# Altium schematic sheet SAMA7G54_PIO.SchDoc
size 420 x 297 mm; SheetNumber: 11; SheetTotal: 34
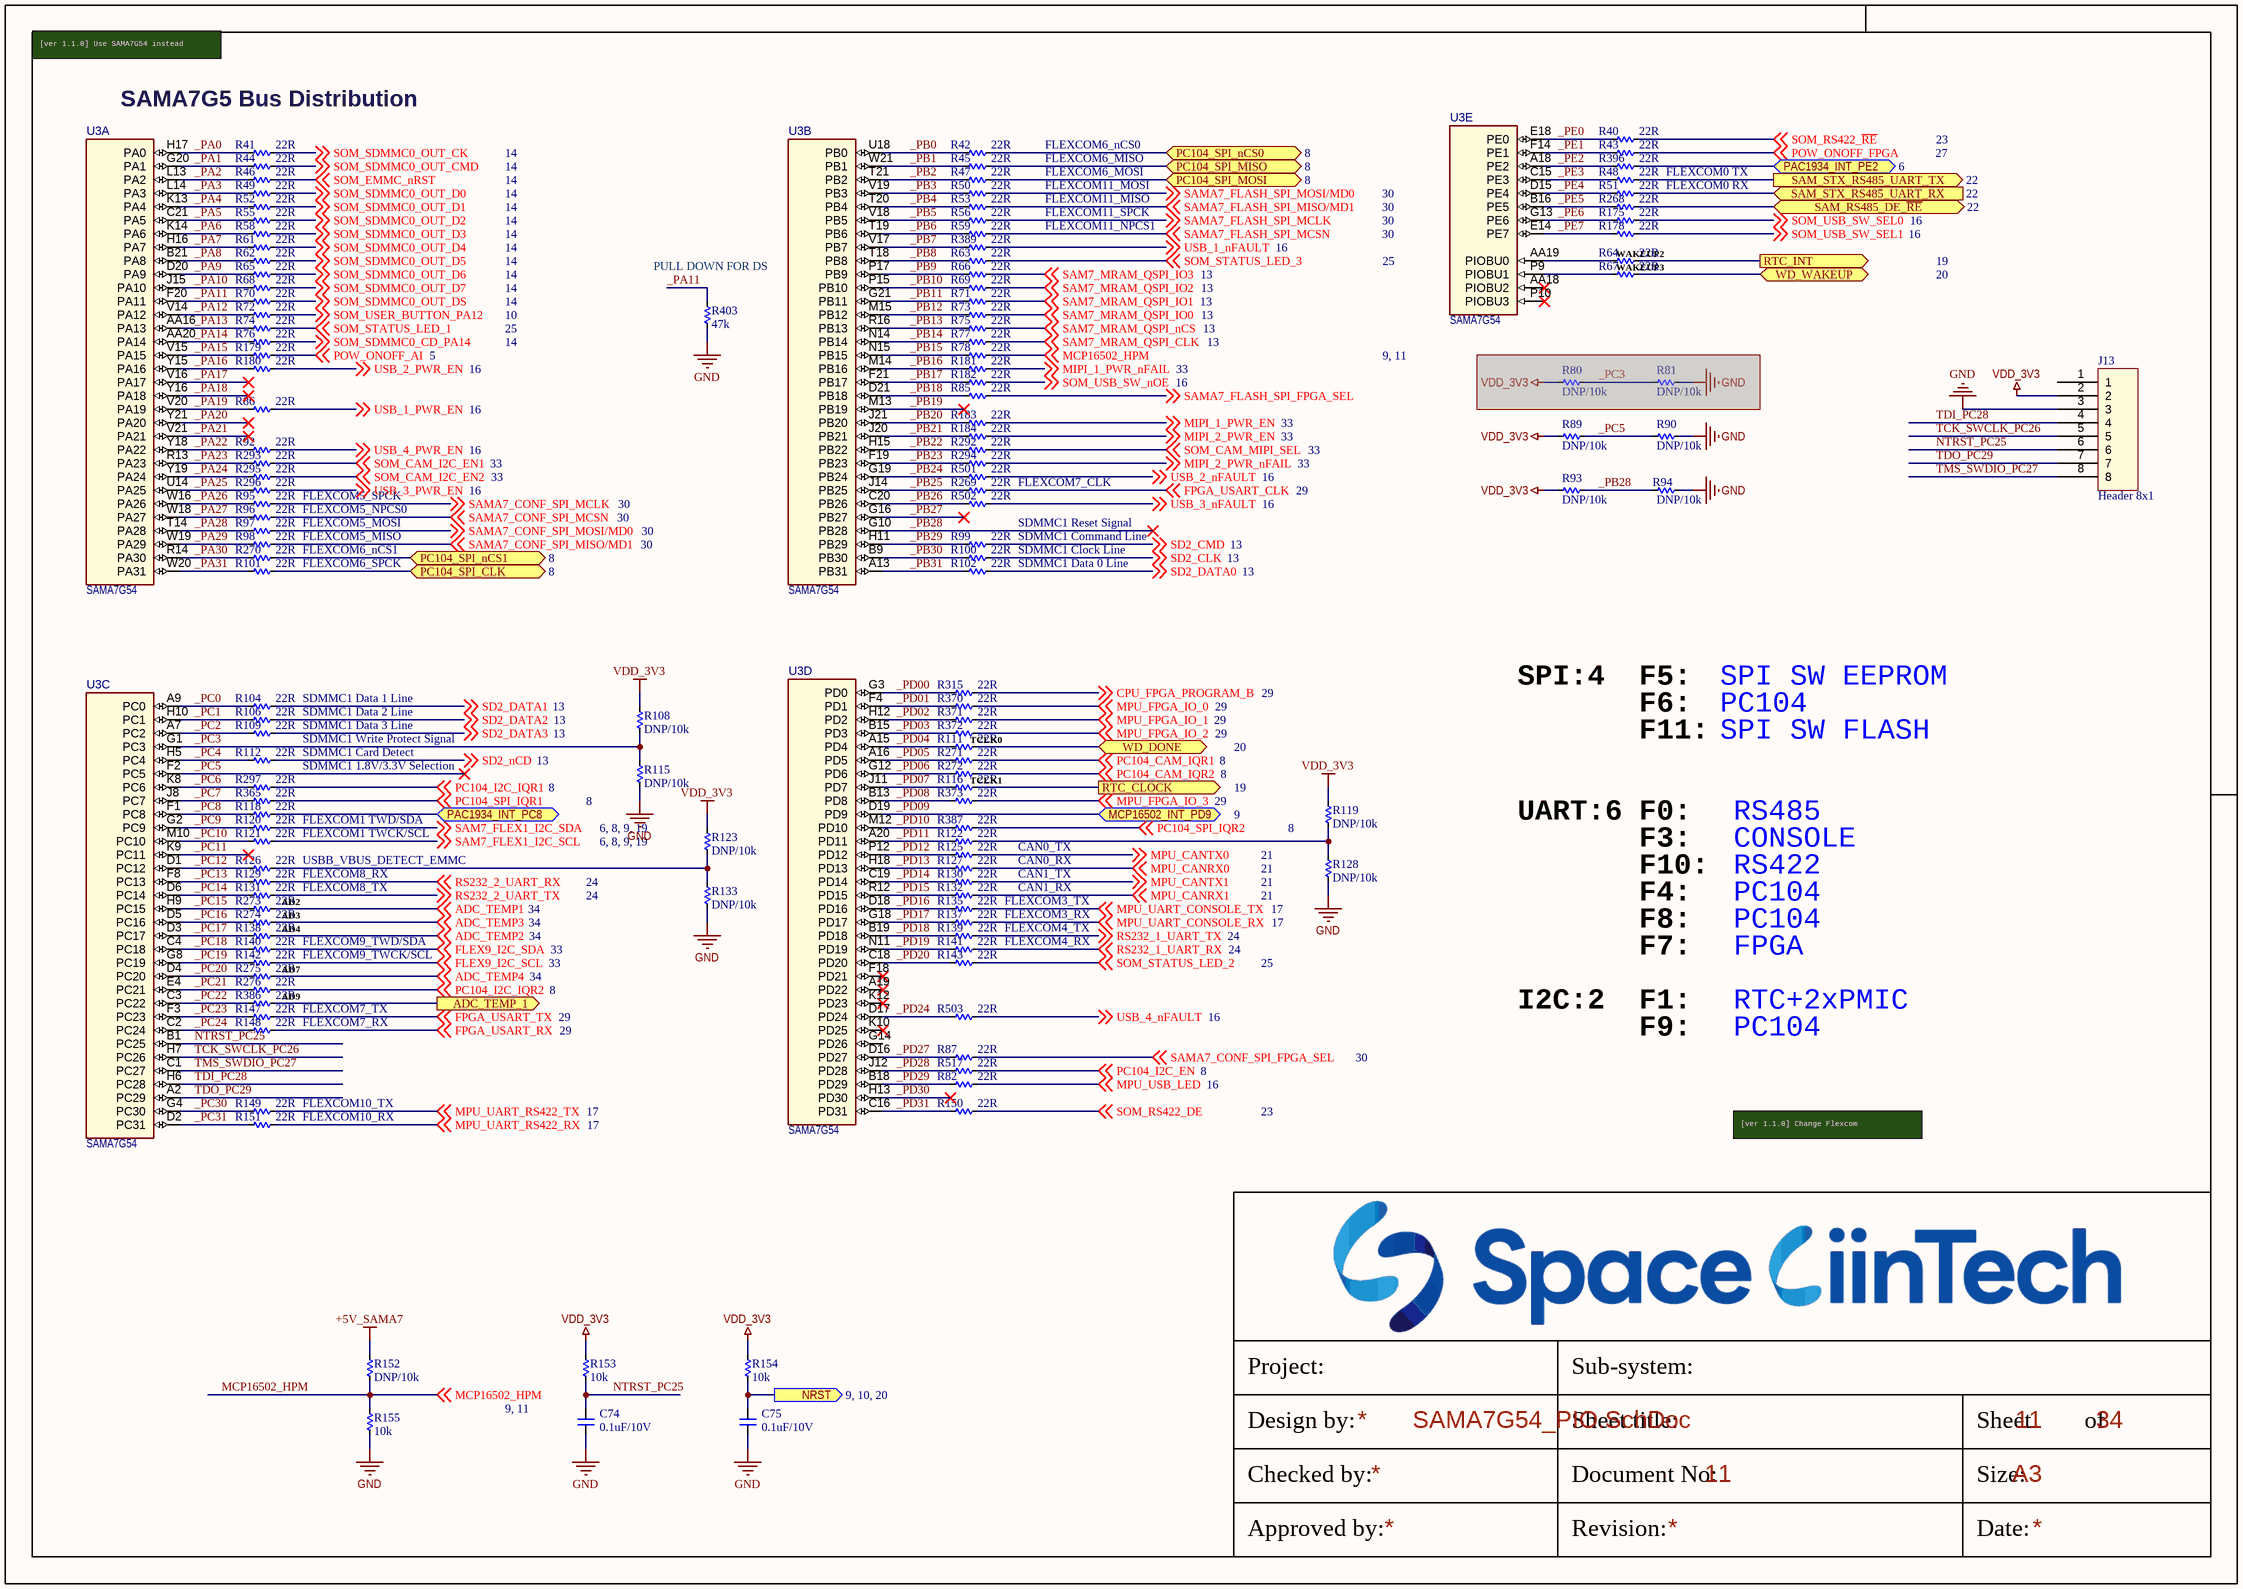
[diagram p0: SAMA7G54_PIO.SchDoc]

## Parts
C74  0.1uF/10V  [CAP_C_1005X50_L]
C75  0.1uF/10V  [CAP_C_1005X50_L]
J13  Header 8x1  [PAD JTAG 1.27]
R40  22R  [RES_C_1005x30_L]
R41  22R  [RES_C_1005x30_L]
R42  22R  [RES_C_1005x30_L]
R43  22R  [RES_C_1005x30_L]
R44  22R  [RES_C_1005x30_L]
R45  22R  [RES_C_1005x30_L]
R46  22R  [RES_C_1005x30_L]
R47  22R  [RES_C_1005x30_L]
R48  22R  [RES_C_1005x30_L]
R49  22R  [RES_C_1005x30_L]
R50  22R  [RES_C_1005x30_L]
R51  22R  [RES_C_1005x30_L]
R52  22R  [RES_C_1005x30_L]
R53  22R  [RES_C_1005x30_L]
R55  22R  [RES_C_1005x30_L]
R56  22R  [RES_C_1005x30_L]
R58  22R  [RES_C_1005x30_L]
R59  22R  [RES_C_1005x30_L]
R61  22R  [RES_C_1005x30_L]
R62  22R  [RES_C_1005x30_L]
R63  22R  [RES_C_1005x30_L]
R64  22R  [RES_C_1005x30_L]
R65  22R  [RES_C_1005x30_L]
R66  22R  [RES_C_1005x30_L]
R67  22R  [RES_C_1005x30_L]
R68  22R  [RES_C_1005x30_L]
R69  22R  [RES_C_1005x30_L]
R70  22R  [RES_C_1005x30_L]
R71  22R  [RES_C_1005x30_L]
R72  22R  [RES_C_1005x30_L]
R73  22R  [RES_C_1005x30_L]
R74  22R  [RES_C_1005x30_L]
R75  22R  [RES_C_1005x30_L]
R76  22R  [RES_C_1005x30_L]
R77  22R  [RES_C_1005x30_L]
R78  22R  [RES_C_1005x30_L]
R80  DNP/10k  [RES_C_1005x30_L]  (masked out: inside a compile mask, not in the netlist)
R81  DNP/10k  [RES_C_1005x30_L]  (masked out: inside a compile mask, not in the netlist)
R82  22R  [RES_C_1005x30_L]
R85  22R  [RES_C_1005x30_L]
R86  22R  [RES_C_1005x30_L]
R87  22R  [RES_C_1005x30_L]
R89  DNP/10k  [RES_C_1005x30_L]
R90  DNP/10k  [RES_C_1005x30_L]
R92  22R  [RES_C_1005x30_L]
R93  DNP/10k  [RES_C_1005x30_L]
R94  DNP/10k  [RES_C_1005x30_L]
R95  22R  [RES_C_1005x30_L]
R96  22R  [RES_C_1005x30_L]
R97  22R  [RES_C_1005x30_L]
R98  22R  [RES_C_1005x30_L]
R99  22R  [RES_C_1005x30_L]
R100  22R  [RES_C_1005x30_L]
R101  22R  [RES_C_1005x30_L]
R102  22R  [RES_C_1005x30_L]
R104  22R  [RES_C_1005x30_L]
R106  22R  [RES_C_1005x30_L]
R108  DNP/10k  [RES_C_1005x30_L]
R109  22R  [RES_C_1005x30_L]
R111  22R  [RES_C_1005x30_L]
R112  22R  [RES_C_1005x30_L]
R115  DNP/10k  [RES_C_1005x30_L]
R116  22R  [RES_C_1005x30_L]
R118  22R  [RES_C_1005x30_L]
R119  DNP/10k  [RES_C_1005x30_L]
R120  22R  [RES_C_1005x30_L]
R121  22R  [RES_C_1005x30_L]
R122  22R  [RES_C_1005x30_L]
R123  DNP/10k  [RES_C_1005x30_L]
R125  22R  [RES_C_1005x30_L]
R126  22R  [RES_C_1005x30_L]
R127  22R  [RES_C_1005x30_L]
R128  DNP/10k  [RES_C_1005x30_L]
R129  22R  [RES_C_1005x30_L]
R130  22R  [RES_C_1005x30_L]
R131  22R  [RES_C_1005x30_L]
R132  22R  [RES_C_1005x30_L]
R133  DNP/10k  [RES_C_1005x30_L]
R135  22R  [RES_C_1005x30_L]
R137  22R  [RES_C_1005x30_L]
R138  22R  [RES_C_1005x30_L]
R139  22R  [RES_C_1005x30_L]
R140  22R  [RES_C_1005x30_L]
R141  22R  [RES_C_1005x30_L]
R142  22R  [RES_C_1005x30_L]
R143  22R  [RES_C_1005x30_L]
R147  22R  [RES_C_1005x30_L]
R148  22R  [RES_C_1005x30_L]
R149  22R  [RES_C_1005x30_L]
R150  22R  [RES_C_1005x30_L]
R151  22R  [RES_C_1005x30_L]
R152  DNP/10k  [RES_C_1005x30_L]
R153  10k  [RES_C_1005x30_L]
R154  10k  [RES_C_1005x30_L]
R155  10k  [RES_C_1005x30_L]
R175  22R  [RES_C_1005x30_L]
R178  22R  [RES_C_1005x30_L]
R179  22R  [RES_C_1005x30_L]
R180  22R  [RES_C_1005x30_L]
R181  22R  [RES_C_1005x30_L]
R182  22R  [RES_C_1005x30_L]
R183  22R  [RES_C_1005x30_L]
R184  22R  [RES_C_1005x30_L]
R268  22R  [RES_C_1005x30_L]
R269  22R  [RES_C_1005x30_L]
R270  22R  [RES_C_1005x30_L]
R271  22R  [RES_C_1005x30_L]
R272  22R  [RES_C_1005x30_L]
R273  22R  [RES_C_1005x30_L]
R274  22R  [RES_C_1005x30_L]
R275  22R  [RES_C_1005x30_L]
R276  22R  [RES_C_1005x30_L]
R292  22R  [RES_C_1005x30_L]
R293  22R  [RES_C_1005x30_L]
R294  22R  [RES_C_1005x30_L]
R295  22R  [RES_C_1005x30_L]
R296  22R  [RES_C_1005x30_L]
R297  22R  [RES_C_1005x30_L]
R315  22R  [RES_C_1005x30_L]
R365  22R  [RES_C_1005x30_L]
R370  22R  [RES_C_1005x30_L]
R371  22R  [RES_C_1005x30_L]
R372  22R  [RES_C_1005x30_L]
R373  22R  [RES_C_1005x30_L]
R386  22R  [RES_C_1005x30_L]
R387  22R  [RES_C_1005x30_L]
R389  22R  [RES_C_1005x30_L]
R396  22R  [RES_C_1005x30_L]
R403  47k  [RES_C_1005x30_L]
R501  22R  [RES_C_1005x30_L]
R502  22R  [RES_C_1005x30_L]
R503  22R  [RES_C_1005x30_L]
R517  22R  [RES_C_1005x30_L]
U3  SAMA7G54  [TFBGA-343_14x14 - 2.5mm]  (parts A,B,C,D,E of 8)

## Ports
ADC_TEMP_1 (out, see 18), MCP16502_INT_PD9 (bidir, see 9), NRST (out, see 9, 10, 20), PAC1934_INT_PC8 (bidir, see 9), PAC1934_INT_PE2 (bidir, see 6), PC104_SPI_CLK (bidir, see 8), PC104_SPI_MISO (bidir, see 8), PC104_SPI_MOSI (bidir, see 8), PC104_SPI_nCS0 (bidir, see 8), PC104_SPI_nCS1 (bidir, see 8), RTC_CLOCK (out, see 19), RTC_INT (out, see 19), SAM_RS485_DE_~{RE} (bidir, see 22), SAM_STX_RS485_UART_RX (in, see 22), SAM_STX_RS485_UART_TX (out, see 22), WD_DONE (bidir, see 20), WD_WAKEUP (bidir, see 20)

## Nets
+5V_SAMA7: R152.1
GND: C74.1 C75.1 J13.3 R90.1 R94.1 R115.2 R128.2 R133.2 R155.2 R403.2
VDD_3V3: J13.2 R89.2 R93.2 R108.1 R119.1 R123.1 R153.2 R154.2
_PA0: R41.2 U3.H17(PA0)
_PA1: R44.2 U3.G20(PA1)
_PA2: R46.2 U3.L13(PA2)
_PA3: R49.2 U3.L14(PA3)
_PA4: R52.2 U3.K13(PA4)
_PA5: R55.2 U3.C21(PA5)
_PA6: R58.2 U3.K14(PA6)
_PA7: R61.2 U3.H16(PA7)
_PA8: R62.2 U3.B21(PA8)
_PA9: R65.2 U3.D20(PA9)
_PA10: R68.2 U3.J15(PA10)
_PA11: R70.2 R403.1 U3.F20(PA11)
_PA12: R72.2 U3.V14(PA12)
_PA13: R74.2 U3.AA16(PA13)
_PA14: R76.2 U3.AA20(PA14)
_PA15: R179.2 U3.V15(PA15)
_PA16: R180.2 U3.Y15(PA16)
_PA17: U3.V16(PA17)
_PA18: U3.Y16(PA18)
_PA19: R86.2 U3.V20(PA19)
_PA20: U3.Y21(PA20)
_PA21: U3.V21(PA21)
_PA22: R92.2 U3.Y18(PA22)
_PA23: R293.2 U3.R13(PA23)
_PA24: R295.2 U3.Y19(PA24)
_PA25: R296.2 U3.U14(PA25)
_PA26: R95.2 U3.W16(PA26)
_PA27: R96.2 U3.W18(PA27)
_PA28: R97.2 U3.T14(PA28)
_PA29: R98.2 U3.W19(PA29)
_PA30: R270.2 U3.R14(PA30)
_PA31: R101.2 U3.W20(PA31)
_PB0: R42.2 U3.U18(PB0)
_PB1: R45.2 U3.W21(PB1)
_PB2: R47.2 U3.T21(PB2)
_PB3: R50.2 U3.V19(PB3)
_PB4: R53.2 U3.T20(PB4)
_PB5: R56.2 U3.V18(PB5)
_PB6: R59.2 U3.T19(PB6)
_PB7: R389.2 U3.V17(PB7)
_PB8: R63.2 U3.T18(PB8)
_PB9: R66.2 U3.P17(PB9)
_PB10: R69.2 U3.P15(PB10)
_PB11: R71.2 U3.G21(PB11)
_PB12: R73.2 U3.M15(PB12)
_PB13: R75.2 U3.R16(PB13)
_PB14: R77.2 U3.N14(PB14)
_PB15: R78.2 U3.N15(PB15)
_PB16: R181.2 U3.M14(PB16)
_PB17: R182.2 U3.F21(PB17)
_PB18: R85.2 U3.D21(PB18)
_PB19: U3.M13(PB19)
_PB20: R183.2 U3.J21(PB20)
_PB21: R184.2 U3.J20(PB21)
_PB22: R292.2 U3.H15(PB22)
_PB23: R294.2 U3.F19(PB23)
_PB24: R501.2 U3.G19(PB24)
_PB25: R269.2 U3.J14(PB25)
_PB26: R502.2 U3.C20(PB26)
_PB27: U3.G16(PB27)
_PB28: R93.1 R94.2 U3.G10(PB28)
_PB29: R99.2 U3.H11(PB29)
_PB30: R100.2 U3.B9(PB30)
_PB31: R102.2 U3.A13(PB31)
_PC0: R104.2 U3.A9(PC0)
_PC1: R106.2 U3.H10(PC1)
_PC2: R109.2 U3.A7(PC2)
_PC3: R108.2 R115.1 U3.G1(PC3)
_PC4: R112.2 U3.H5(PC4)
_PC5: R89.1 R90.2 U3.F2(PC5)
_PC6: R297.2 U3.K8(PC6)
_PC7: R365.2 U3.J8(PC7)
_PC8: R118.2 U3.F1(PC8)
_PC9: R120.2 U3.G2(PC9)
_PC10: R121.2 U3.M10(PC10)
_PC11: U3.K9(PC11)
_PC12: R126.2 U3.D1(PC12)
_PC13: R129.2 U3.F8(PC13)
_PC14: R131.2 U3.D6(PC14)
_PC15: R273.2 U3.H9(PC15)
_PC16: R274.2 U3.D5(PC16)
_PC17: R138.2 U3.D3(PC17)
_PC18: R140.2 U3.C4(PC18)
_PC19: R142.2 U3.G8(PC19)
_PC20: R275.2 U3.D4(PC20)
_PC21: R276.2 U3.E4(PC21)
_PC22: R386.2 U3.C3(PC22)
_PC23: R147.2 U3.F3(PC23)
_PC24: R148.2 U3.C2(PC24)
_PC30: R149.2 U3.G4(PC30)
_PC31: R151.2 U3.D2(PC31)
_PD00: R315.2 U3.G3(PD0)
_PD01: R370.2 U3.F4(PD1)
_PD02: R371.2 U3.H12(PD2)
_PD03: R372.2 U3.B15(PD3)
_PD04: R111.2 U3.A15(PD4)
_PD05: R271.2 U3.A16(PD5)
_PD06: R272.2 U3.G12(PD6)
_PD07: R116.2 U3.J11(PD7)
_PD08: R373.2 U3.B13(PD8)
_PD09: U3.D19(PD9) ; port MCP16502_INT_PD9
_PD10: R387.2 U3.M12(PD10)
_PD11: R122.2 U3.A20(PD11)
_PD12: R125.2 U3.P12(PD12)
_PD13: R127.2 U3.H18(PD13)
_PD14: R130.2 U3.C19(PD14)
_PD15: R132.2 U3.R12(PD15)
_PD16: R135.2 U3.D18(PD16)
_PD17: R137.2 U3.G18(PD17)
_PD18: R139.2 U3.B19(PD18)
_PD19: R141.2 U3.N11(PD19)
_PD20: R143.2 U3.C18(PD20)
_PD24: R503.2 U3.D17(PD24)
_PD27: R87.2 U3.D16(PD27)
_PD28: R517.2 U3.J12(PD28)
_PD29: R82.2 U3.B18(PD29)
_PD30: U3.H13(PD30)
_PD31: R150.2 U3.C16(PD31)
_PE0: R40.2 U3.E18(PE0)
_PE1: R43.2 U3.F14(PE1)
_PE2: R396.2 U3.A18(PE2)
_PE3: R48.2 U3.C15(PE3)
_PE4: R51.2 U3.D15(PE4)
_PE5: R268.2 U3.B16(PE5)
_PE6: R175.2 U3.G13(PE6)
_PE7: R178.2 U3.E14(PE7)
ADC_TEMP1: R273.1 ; off-sheet ADC_TEMP1
ADC_TEMP2: R138.1 ; off-sheet ADC_TEMP2
ADC_TEMP3: R274.1 ; off-sheet ADC_TEMP3
ADC_TEMP4: R275.1 ; off-sheet ADC_TEMP4
ADC_TEMP_1: R386.1 ; port ADC_TEMP_1
CPU_FPGA_PROGRAM_B: R315.1 ; off-sheet CPU_FPGA_PROGRAM_B
FLEX9_I2C_SCL: R142.1 ; off-sheet FLEX9_I2C_SCL
FLEX9_I2C_SDA: R140.1 ; off-sheet FLEX9_I2C_SDA
FPGA_USART_CLK: R269.1 ; off-sheet FPGA_USART_CLK
FPGA_USART_RX: R148.1 ; off-sheet FPGA_USART_RX
FPGA_USART_TX: R147.1 ; off-sheet FPGA_USART_TX
MCP16502_HPM: R78.1 R152.2 R155.1 ; off-sheet MCP16502_HPM
MIPI_1_PWR_EN: R183.1 ; off-sheet MIPI_1_PWR_EN
MIPI_1_PWR_nFAIL: R181.1 ; off-sheet MIPI_1_PWR_nFAIL
MIPI_2_PWR_EN: R184.1 ; off-sheet MIPI_2_PWR_EN
MIPI_2_PWR_nFAIL: R294.1 ; off-sheet MIPI_2_PWR_nFAIL
MPU_CANRX0: R127.1 ; off-sheet MPU_CANRX0
MPU_CANRX1: R132.1 ; off-sheet MPU_CANRX1
MPU_CANTX0: R125.1 ; off-sheet MPU_CANTX0
MPU_CANTX1: R130.1 ; off-sheet MPU_CANTX1
MPU_FPGA_IO_0: R370.1 ; off-sheet MPU_FPGA_IO_0
MPU_FPGA_IO_1: R371.1 ; off-sheet MPU_FPGA_IO_1
MPU_FPGA_IO_2: R372.1 ; off-sheet MPU_FPGA_IO_2
MPU_FPGA_IO_3: R373.1 ; off-sheet MPU_FPGA_IO_3
MPU_UART_CONSOLE_RX: R137.1 ; off-sheet MPU_UART_CONSOLE_RX
MPU_UART_CONSOLE_TX: R135.1 ; off-sheet MPU_UART_CONSOLE_TX
MPU_UART_RS422_RX: R151.1 ; off-sheet MPU_UART_RS422_RX
MPU_UART_RS422_TX: R149.1 ; off-sheet MPU_UART_RS422_TX
MPU_USB_LED: R82.1 ; off-sheet MPU_USB_LED
NRST: C75.2 R154.1 ; port NRST
NTRST_PC25: C74.2 J13.6 R153.1 U3.B1(PC25)
PAC1934_INT_PC8: R118.1 ; port PAC1934_INT_PC8
PAC1934_INT_PE2: R396.1 ; port PAC1934_INT_PE2
PC104_CAM_IQR1: R271.1 ; off-sheet PC104_CAM_IQR1
PC104_CAM_IQR2: R272.1 ; off-sheet PC104_CAM_IQR2
PC104_I2C_EN: R517.1 ; off-sheet PC104_I2C_EN
PC104_I2C_IQR1: R297.1 ; off-sheet PC104_I2C_IQR1
PC104_I2C_IQR2: R276.1 ; off-sheet PC104_I2C_IQR2
PC104_SPI_CLK: R101.1 ; port PC104_SPI_CLK
PC104_SPI_IQR1: R365.1 ; off-sheet PC104_SPI_IQR1
PC104_SPI_IQR2: R387.1 ; off-sheet PC104_SPI_IQR2
PC104_SPI_MISO: R45.1 ; port PC104_SPI_MISO
PC104_SPI_MOSI: R47.1 ; port PC104_SPI_MOSI
PC104_SPI_nCS0: R42.1 ; port PC104_SPI_nCS0
PC104_SPI_nCS1: R270.1 ; port PC104_SPI_nCS1
POW_ONOFF_AI: R179.1 ; off-sheet POW_ONOFF_AI
POW_ONOFF_FPGA: R43.1 ; off-sheet POW_ONOFF_FPGA
RS232_1_UART_RX: R141.1 ; off-sheet RS232_1_UART_RX
RS232_1_UART_TX: R139.1 ; off-sheet RS232_1_UART_TX
RS232_2_UART_RX: R129.1 ; off-sheet RS232_2_UART_RX
RS232_2_UART_TX: R131.1 ; off-sheet RS232_2_UART_TX
RTC_CLOCK: R116.1 ; port RTC_CLOCK
RTC_INT: R64.1 ; port RTC_INT
SAM7_FLEX1_I2C_SCL: R121.1 ; off-sheet SAM7_FLEX1_I2C_SCL
SAM7_FLEX1_I2C_SDA: R120.1 ; off-sheet SAM7_FLEX1_I2C_SDA
SAM7_MRAM_QSPI_CLK: R77.1 ; off-sheet SAM7_MRAM_QSPI_CLK
SAM7_MRAM_QSPI_IO0: R73.1 ; off-sheet SAM7_MRAM_QSPI_IO0
SAM7_MRAM_QSPI_IO1: R71.1 ; off-sheet SAM7_MRAM_QSPI_IO1
SAM7_MRAM_QSPI_IO2: R69.1 ; off-sheet SAM7_MRAM_QSPI_IO2
SAM7_MRAM_QSPI_IO3: R66.1 ; off-sheet SAM7_MRAM_QSPI_IO3
SAM7_MRAM_QSPI_nCS: R75.1 ; off-sheet SAM7_MRAM_QSPI_nCS
SAM_RS485_DE_~{RE}: R268.1 ; port SAM_RS485_DE_~{RE}
SAM_STX_RS485_UART_RX: R51.1 ; port SAM_STX_RS485_UART_RX
SAM_STX_RS485_UART_TX: R48.1 ; port SAM_STX_RS485_UART_TX
SAMA7_CONF_SPI_FPGA_SEL: R87.1 ; off-sheet SAMA7_CONF_SPI_FPGA_SEL
SAMA7_CONF_SPI_MCLK: R95.1 ; off-sheet SAMA7_CONF_SPI_MCLK
SAMA7_CONF_SPI_MCSN: R96.1 ; off-sheet SAMA7_CONF_SPI_MCSN
SAMA7_CONF_SPI_MISO/MD1: R98.1 ; off-sheet SAMA7_CONF_SPI_MISO/MD1
SAMA7_CONF_SPI_MOSI/MD0: R97.1 ; off-sheet SAMA7_CONF_SPI_MOSI/MD0
SAMA7_FLASH_SPI_FPGA_SEL: R85.1 ; off-sheet SAMA7_FLASH_SPI_FPGA_SEL
SAMA7_FLASH_SPI_MCLK: R56.1 ; off-sheet SAMA7_FLASH_SPI_MCLK
SAMA7_FLASH_SPI_MCSN: R59.1 ; off-sheet SAMA7_FLASH_SPI_MCSN
SAMA7_FLASH_SPI_MISO/MD1: R53.1 ; off-sheet SAMA7_FLASH_SPI_MISO/MD1
SAMA7_FLASH_SPI_MOSI/MD0: R50.1 ; off-sheet SAMA7_FLASH_SPI_MOSI/MD0
SD2_CLK: R100.1 ; off-sheet SD2_CLK
SD2_CMD: R99.1 ; off-sheet SD2_CMD
SD2_DATA0: R102.1 ; off-sheet SD2_DATA0
SD2_DATA1: R104.1 ; off-sheet SD2_DATA1
SD2_DATA2: R106.1 ; off-sheet SD2_DATA2
SD2_DATA3: R109.1 ; off-sheet SD2_DATA3
SD2_nCD: R112.1 ; off-sheet SD2_nCD
SOM_CAM_I2C_EN1: R293.1 ; off-sheet SOM_CAM_I2C_EN1
SOM_CAM_I2C_EN2: R295.1 ; off-sheet SOM_CAM_I2C_EN2
SOM_CAM_MIPI_SEL: R292.1 ; off-sheet SOM_CAM_MIPI_SEL
SOM_EMMC_nRST: R46.1 ; off-sheet SOM_EMMC_nRST
SOM_RS422_DE: R150.1 ; off-sheet SOM_RS422_DE
SOM_RS422_~{RE}: R40.1 ; off-sheet SOM_RS422_~{RE}
SOM_SDMMC0_CD_PA14: R76.1 ; off-sheet SOM_SDMMC0_CD_PA14
SOM_SDMMC0_OUT_CK: R41.1 ; off-sheet SOM_SDMMC0_OUT_CK
SOM_SDMMC0_OUT_CMD: R44.1 ; off-sheet SOM_SDMMC0_OUT_CMD
SOM_SDMMC0_OUT_D0: R49.1 ; off-sheet SOM_SDMMC0_OUT_D0
SOM_SDMMC0_OUT_D1: R52.1 ; off-sheet SOM_SDMMC0_OUT_D1
SOM_SDMMC0_OUT_D2: R55.1 ; off-sheet SOM_SDMMC0_OUT_D2
SOM_SDMMC0_OUT_D3: R58.1 ; off-sheet SOM_SDMMC0_OUT_D3
SOM_SDMMC0_OUT_D4: R61.1 ; off-sheet SOM_SDMMC0_OUT_D4
SOM_SDMMC0_OUT_D5: R62.1 ; off-sheet SOM_SDMMC0_OUT_D5
SOM_SDMMC0_OUT_D6: R65.1 ; off-sheet SOM_SDMMC0_OUT_D6
SOM_SDMMC0_OUT_D7: R68.1 ; off-sheet SOM_SDMMC0_OUT_D7
SOM_SDMMC0_OUT_DS: R70.1 ; off-sheet SOM_SDMMC0_OUT_DS
SOM_STATUS_LED_1: R74.1 ; off-sheet SOM_STATUS_LED_1
SOM_STATUS_LED_2: R143.1 ; off-sheet SOM_STATUS_LED_2
SOM_STATUS_LED_3: R63.1 ; off-sheet SOM_STATUS_LED_3
SOM_USB_SW_nOE: R182.1 ; off-sheet SOM_USB_SW_nOE
SOM_USB_SW_SEL0: R175.1 ; off-sheet SOM_USB_SW_SEL0
SOM_USB_SW_SEL1: R178.1 ; off-sheet SOM_USB_SW_SEL1
SOM_USER_BUTTON_PA12: R72.1 ; off-sheet SOM_USER_BUTTON_PA12
TCK_SWCLK_PC26: J13.5 U3.H7(PC26)
TDI_PC28: J13.4 U3.H6(PC28)
TDO_PC29: J13.7 U3.A2(PC29)
TMS_SWDIO_PC27: J13.8 U3.C1(PC27)
USB_1_nFAULT: R389.1 ; off-sheet USB_1_nFAULT
USB_1_PWR_EN: R86.1 ; off-sheet USB_1_PWR_EN
USB_2_nFAULT: R501.1 ; off-sheet USB_2_nFAULT
USB_2_PWR_EN: R180.1 ; off-sheet USB_2_PWR_EN
USB_3_nFAULT: R502.1 ; off-sheet USB_3_nFAULT
USB_3_PWR_EN: R296.1 ; off-sheet USB_3_PWR_EN
USB_4_nFAULT: R503.1 ; off-sheet USB_4_nFAULT
USB_4_PWR_EN: R92.1 ; off-sheet USB_4_PWR_EN
WD_DONE: R111.1 ; port WD_DONE
WD_WAKEUP: R67.1 ; port WD_WAKEUP
NetR64_2: R64.2 U3.AA19(PIOBU0)
NetR67_2: R67.2 U3.P9(PIOBU1)
NetR119_2: R119.2 R122.1 R128.1
NetR123_2: R123.2 R126.1 R133.1

Not connected (* = marked no-connect by the designer): J13 1; U3 A19(PD22)* AA18(PIOBU2)* F18(PD21)* G14(PD26) K10(PD25)* K12(PD23)* P10(PIOBU3)*

## Notes on the sheet
- [ver 1.1.0] Use SAMA7G54 instead
- SAMA7G5 Bus Distribution
- FLEXCOM6_MOSI
- FLEXCOM6_MISO
- FLEXCOM6_nCS0
- FLEXCOM11_MOSI
- FLEXCOM0 RX
- FLEXCOM0 TX
- FLEXCOM11_SPCK
- FLEXCOM11_NPCS1
- FLEXCOM11_MISO
- WAKEUP2
- (near R403) PULL DOWN FOR DS
- WAKEUP3
- FLEXCOM5_SPCK
- FLEXCOM5_NPCS0
- FLEXCOM5_MOSI
- SDMMC1 Reset Signal
- FLEXCOM7_CLK
- FLEXCOM6_SPCK
- FLEXCOM6_nCS1
- FLEXCOM5_MISO
- SDMMC1 Command Line
- SDMMC1 Data 0 Line
- SDMMC1 Clock Line
- SDMMC1 Data 1 Line
- SDMMC1 Data 2 Line
- SDMMC1 Data 3 Line
- SPI:4
- F5:
- F6:
- SPI SW EEPROM
- PC104
- SDMMC1 Write Protect Signal
- SDMMC1 Card Detect
- SDMMC1 1.8V/3.3V Selection
- TCLK1
- TCLK0
- F11:
- SPI SW FLASH
- FLEXCOM1 TWD/SDA
- FLEXCOM1 TWCK/SCL
- USBB_VBUS_DETECT_EMMC
- CAN0_TX
- CAN0_RX
- UART:6
- F0:
- F3:
- RS485
- CONSOLE
- FLEXCOM8_RX
- FLEXCOM8_TX
- AD2
- AD3
- AD4
- FLEXCOM3_RX
- FLEXCOM3_TX
- FLEXCOM4_TX
- CAN1_TX
- CAN1_RX
- F10:
- F4:
- F8:
- RS422
- FLEXCOM9_TWD/SDA
- FLEXCOM9_TWCK/SCL
- AD9
- AD7
- FLEXCOM4_RX
- F7:
- FPGA
- FLEXCOM7_TX
- FLEXCOM7_RX
- I2C:2
- F1:
- F9:
- RTC+2xPMIC
- FLEXCOM10_TX
- FLEXCOM10_RX
- [ver 1.1.0] Change Flexcom
- Project:
- Sub-system:
- Design by:
- Sheet title:
- Sheet
- of
- Checked by:
- Approved by:
- Revision:
- Document No:
- Size:
- Date:
- A3

## Library data of the parts
C74 C75 = _CAP_C_2: CAP
R40-R53 R55 R56 R58 R59 R61-R78 R80-R82 R85-R87 R89 R90 R92-R102 R104 R106 R108 R109 R111 R112 R115 R116 R118-R123 R125-R133 R135 R137-R143 R147-R155 R175 R178-R184 R268-R276 R292-R297 R315 R365 R370-R373 R386 R387 R389 R396 R403 R501-R503 R517 = _RES_B_2: RES
U3 = SAMA7G54: SAMA7G54 MPU 1000MHz Cortex-A7 TFBGA-343; Manufacturer Part Number 1: SAMA7G54-V/4HB; Manufacturer 1: Microchip; Description_: MCHP MPU 32-BIT Cortex-A7 1000MHz 128kB SAMA7G54-V/4HB TFBGA-343; Populated: YES; MCHP-ID: MIC8923; Symbol: SAMA7G54 TFBGA-343; Dev Tools Status: Design; Owner: Ciprian Abramov; Package: TFBGA-343; Value: SAMA7G54; Type: 32-Bit MPU; Status: MCL Design; Revision: 1; Category: MCHP-Microcontroller; ComponentLink1Description: SVN Datasheet; ComponentLink2Description: Local Datasheet; ComponentLink3URL: C:\ALTIUM_WORK\00001_MCHP-CDB\Library\LibraryRefs\SAMA7G54 TFBGA-343.SchLib; ComponentLink3Description: Open Symbol; ComponentLink4URL: C:\ALTIUM_WORK\00001_MCHP-CDB\Library\Footprints\TFBGA-343_14x14.PcbLib; ComponentLink4Description: Open Footprint; ComponentLink5Description: Open Footprint 2; ComponentLink6Description: Open Footprint 3; ComponentLink7Description: Open Footprint 4; Supplier 1: Microchip; Supplier Part Number 1: SAMA7G54-V/4HB; Quantity Override: 1